# Altium schematic sheet CameraJPEG.SchDoc
size A3; PageSetup: Record=PageOptions|CenterHorizontal=True|CenterVertical=True|PrintScale=0.75|XCorrection=1.00|YCorrection=1.00|PrintKind=1|BorderSize=5000000|LeftOffset=0|BottomOffset=0|Orientation=2|PaperLength=1000|PaperWidth=1000|Scale=100|PaperSource=259|PrintQuality=-3|MediaType=1|DitherType=10|PrintScaleMode=1|PaperKind=A4|PaperIndex=9
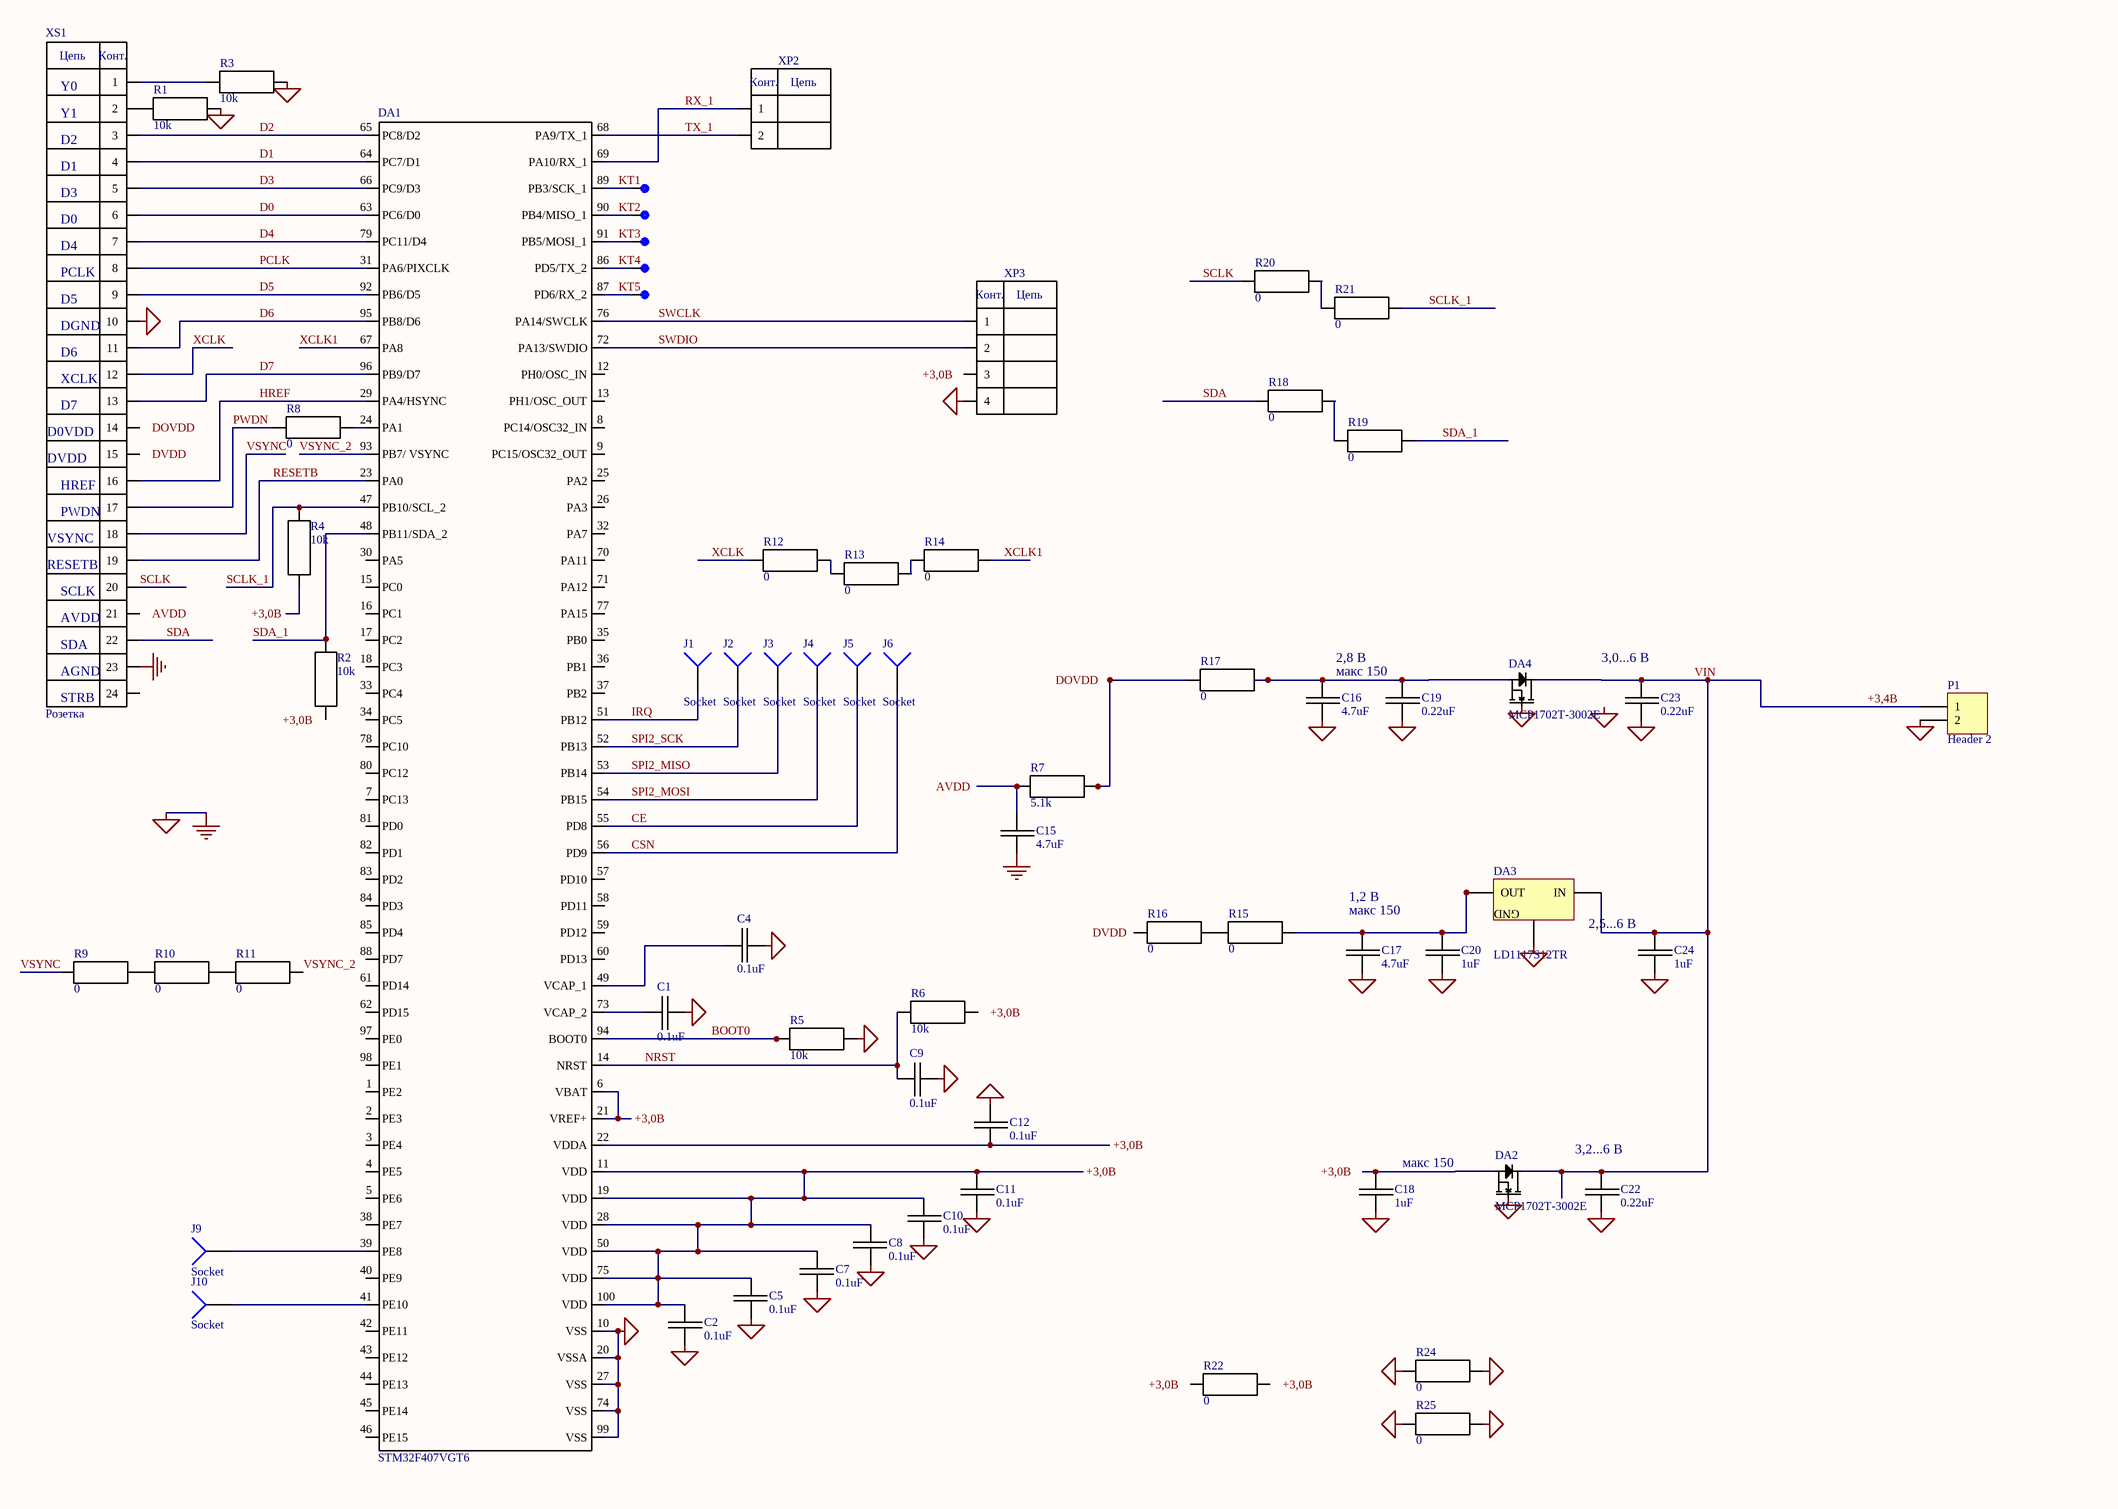
[diagram p0: CameraJPEG.SchDoc]

## Parts
C1  0.1uF  [CAP0805]
C2  0.1uF  [CAP0805]
C4  0.1uF  [CAP0805]
C5  0.1uF  [CAP0805]
C7  0.1uF  [CAP0805]
C8  0.1uF  [CAP0805]
C9  0.1uF  [CAP0805]
C10  0.1uF  [CAP0805]
C11  0.1uF  [CAP0805]
C12  0.1uF  [CAP0805]
C15  4.7uF  [CAP0805]
C16  4.7uF  [CAP0805]
C17  4.7uF  [CAP0805]
C18  1uF  [CAP0805]
C19  0.22uF  [CAP0805]
C20  1uF  [CAP0805]
C22  0.22uF  [CAP0805]
C23  0.22uF  [CAP0805]
C24  1uF  [CAP0805]
DA1  STM32F407VGT6  [STM32F407VGT6]
DA2  MCP1702T-3002E  [SOT23]
DA3  LD1117S12TR  [SOT-223]
DA4  MCP1702T-3002E  [SOT23]
J1  Socket  [PIN1]
J2  Socket  [PIN1]
J3  Socket  [PIN1]
J4  Socket  [PIN1]
J5  Socket  [PIN1]
J6  Socket  [PIN1]
J9  Socket  [PIN1]
J10  Socket  [PIN1]
KT1  *  [PAD]  (value not drawn)
KT2  *  [PAD]  (value not drawn)
KT3  *  [PAD]  (value not drawn)
KT4  *  [PAD]  (value not drawn)
KT5  *  [PAD]  (value not drawn)
P1  Header 2  [HDR1X2]
R1  10k  [RES0603]
R2  10k  [RES0603]
R3  10k  [RES0603]
R4  10k  [RES0603]
R5  10k  [RES0603]
R6  10k  [RES0603]
R7  5.1k  [RES0603]
R8  0  [RES0603]
R9  0  [RES0603]
R10  0  [RES0603]
R11  0  [RES0603]
R12  0  [RES0603]
R13  0  [RES0603]
R14  0  [RES0603]
R15  0  [RES0603]
R16  0  [RES0603]
R17  0  [RES0603]
R18  0  [RES0603]
R19  0  [RES0603]
R20  0  [RES0603]
R21  0  [RES0603]
R22  0  [RES0603]
R24  0  [RES1206]
R25  0  [RES1206]
XP2  Вилка PLS2-2  [PLS2-2]  (value not drawn)
XP3  Вилка PLS2-4  [PLS2-4]  (value not drawn)
XS1  Розетка  [Розетка под FPC_1]

## Ports
+3,0B (out), AVDD (out), DOVDD (out), DVDD (out)

## Nets
GND: C1.2 C2.1 C4.1 C5.2 C7.2 C8.2 C9.2 C10.1 C11.1 C12.2 C15.1 C16.1 C17.1 C18.1 C19.1 C20.1 C22.1 C23.1 C24.1 DA1.10(VSS) DA1.20(VSSA) DA1.27(VSS) DA1.74(VSS) DA1.99(VSS) DA2.1(G) DA3.1(GND) DA4.1(G) P1.2 R1.2 R3.2 R5.2 R24.1 R24.2 R25.1 R25.2 XP3.4 XS1.10 XS1.23
+3,0B: C2.2 C5.1 C7.1 C8.1 C10.2 C11.2 C12.1 C18.2 DA1.6(VBAT) DA1.11(VDD) DA1.19(VDD) DA1.21(VREF+) DA1.22(VDDA) DA1.28(VDD) DA1.50(VDD) DA1.75(VDD) DA1.100(VDD) DA2.2(S) R2.1 R4.1 R6.2 R22.1 R22.2 XP3.3 ; port +3,0B
+3,4B: C22.2 C23.2 C24.2 DA2.3(D) DA3.3(IN) DA4.3(D) P1.1  [also labelled VIN]
AVDD: C15.2 R7.1 XS1.21 ; port AVDD
BOOT0: DA1.94(BOOT0) R5.1
CE: DA1.55(PD8) J5.1
CSN: DA1.56(PD9) J6.1
D0: DA1.63(PC6/D0) XS1.6
D1: DA1.64(PC7/D1) XS1.4
D2: DA1.65(PC8/D2) XS1.3
D3: DA1.66(PC9/D3) XS1.5
D4: DA1.79(PC11/D4) XS1.7
D5: DA1.92(PB6/D5) XS1.9
D6: DA1.95(PB8/D6) XS1.11
D7: DA1.96(PB9/D7) XS1.13
DOVDD: R7.2 R17.1 XS1.14 ; port DOVDD
DVDD: R16.1 XS1.15 ; port DVDD
HREF: DA1.29(PA4/HSYNC) XS1.16
IRQ: DA1.51(PB12) J1.1
KT1: DA1.89(PB3/SCK_1) KT1.1
KT2: DA1.90(PB4/MISO_1) KT2.1
KT3: DA1.91(PB5/MOSI_1) KT3.1
KT4: DA1.86(PD5/TX_2) KT4.1
KT5: DA1.87(PD6/RX_2) KT5.1
NRST: C9.1 DA1.14(NRST) R6.1
PCLK: DA1.31(PA6/PIXCLK) XS1.8
PWDN: R8.1 XS1.17
RESETB: DA1.23(PA0) XS1.19
RX_1: DA1.69(PA10/RX_1) XP2.1
SCLK: R20.1 XS1.20
SCLK_1: DA1.47(PB10/SCL_2) R4.2 R21.2
SDA: R18.1 XS1.22
SDA_1: DA1.48(PB11/SDA_2) R2.2 R19.2
SPI2_MISO: DA1.53(PB14) J3.1
SPI2_MOSI: DA1.54(PB15) J4.1
SPI2_SCK: DA1.52(PB13) J2.1
SWCLK: DA1.76(PA14/SWCLK) XP3.1
SWDIO: DA1.72(PA13/SWDIO) XP3.2
TX_1: DA1.68(PA9/TX_1) XP2.2
VSYNC: R9.1 XS1.18
VSYNC_2: DA1.93(PB7/_VSYNC) R11.2
XCLK: R12.1 XS1.12
XCLK1: DA1.67(PA8) R14.2
NetC1_1: C1.1 DA1.73(VCAP_2)
NetC4_2: C4.2 DA1.49(VCAP_1)
NetC16_2: C16.2 C19.2 DA4.2(S) R17.2
NetC17_2: C17.2 C20.2 DA3.2(OUT) DA3.4 R15.2
NetDA1_24: DA1.24(PA1) R8.2
NetDA1_39: DA1.39(PE8) J9.1
NetDA1_41: DA1.41(PE10) J10.1
NetR1_1: R1.1 XS1.2
NetR3_1: R3.1 XS1.1
NetR9_2: R9.2 R10.1
NetR10_2: R10.2 R11.1
NetR12_2: R12.2 R13.1
NetR13_2: R13.2 R14.1
NetR15_1: R15.1 R16.2
NetR18_2: R18.2 R19.1
NetR20_2: R20.2 R21.1

Not connected (* = marked no-connect by the designer): DA1 1(PE2) 2(PE3) 3(PE4) 4(PE5) 5(PE6) 7(PC13) 8(PC14/OSC32_IN) 9(PC15/OSC32_OUT) 12(PH0/OSC_IN) 13(PH1/OSC_OUT) 15(PC0) 16(PC1) 17(PC2) 18(PC3) 25(PA2) 26(PA3) 30(PA5) 32(PA7) 33(PC4) 34(PC5) 35(PB0) 36(PB1) 37(PB2) 38(PE7) 40(PE9) 42(PE11) 43(PE12) 44(PE13) 45(PE14) 46(PE15) 57(PD10) 58(PD11) 59(PD12) 60(PD13) 61(PD14) 62(PD15) 70(PA11) 71(PA12) 77(PA15) 78(PC10) 80(PC12) 81(PD0) 82(PD1) 83(PD2) 84(PD3) 85(PD4) 88(PD7) 97(PE0) 98(PE1); XS1 24

## Notes on the sheet
- Y0
- (near XS1) D1
- (near XS1) D2
- Y1
- (near XS1) D0
- (near XS1) D3
- (near XS1) D4
- (near XS1) PCLK
- (near XS1) D5
- (near XS1) XCLK
- (near XS1) DGND
- (near XS1) D6
- (near XS1) D0VDD
- (near XS1) D7
- (near XS1) DVDD
- (near XS1) PWDN
- (near XS1) HREF
- (near XS1) RESETB
- (near XS1) VSYNC
- (near XS1) SDA
- (near XS1) AVDD
- (near XS1) SCLK
- (near XS1) STRB
- (near XS1) AGND
- 2,8 B
- макс 150
- (near C23) 3,0...6 B
- (near C17) 1,2 B
- (near C17) макс 150
- 2,5...6 B
- (near C18) макс 150
- (near C22) 3,2...6 B
- Labels drawn without touching a wire or pin: GND
- (in symbol Вилка PLS2-2) Конт.; Цепь
- (in symbol Вилка PLS2-4) Конт.; Цепь
- (in symbol Розетка на плату под шлейф 24_1) Цепь; Конт.

## Library data of the parts
C1 C2 C4 C5 C7-C12 C15-C20 C22-C24 = Capacitor: Voltage: 50V; dielectric: X7R
  C1 C2 C4 C5 C7-C12: Value: 0.1uF
  C15-C17: Value: 4.7uF
  C18 C20 C24: Value: 1uF
  C19 C22 C23: Value: 0.22uF
DA1 = STM32F407VGT6: Manufacturer: STMicroelectronics; Additionally: *; Note: *; PartNumber: STM32F407VGT6; Pattern: *; PowerSupply: *; Tolerance: *; Наименование: *; Value: *
DA2 DA4 = 2N7002: Vds: 60V; Rds: 2-4; Id: 300mA; Vgs: 1...2.5V
DA3 = DA-AMS1117: LDO 3.3V 0.5A; Vin: ...15V; Iout: 0.8A; Vout: 1.2V
KT1-KT5 = KT: Additionally: *; Manufacturer: *; Note: *; PartNumber: *; Pattern: *; PowerSupply: *; Tolerance: *; Наименование: *; Value: *
P1 = Header 2: Header, 2-Pin; LatestRevisionDate: 17-Jul-2002; LatestRevisionNote: Re-released for DXP Platform.; Publisher: Altium Limited
R1-R22 R24 R25 = Resistor: Toleance: 1%
  R1-R6: Value: 10k
  R7: Value: 5.1k
  R8-R22 R24 R25: Value: 0
XP2 = Вилка PLS2-2: Manufacturer: Dragon City; Additionally: *; Note: *; PartNumber: Вилка PLS2-2; Pattern: *; PowerSupply: *; Tolerance: *; Наименование: *; Value: *
XP3 = Вилка PLS2-4: Manufacturer: Dragon City; Additionally: *; Note: *; PartNumber: Вилка PLS2-4; Pattern: *; PowerSupply: *; Tolerance: *; Наименование: *; Value: *
XS1 = Розетка на плату под шлейф 24_1: Additionally: *; Note: *; PartNumber: Розетка; Pattern: *; PowerSupply: *; Tolerance: *; Наименование: *; Value: *
J1-J6 J9 J10 = Socket: LatestRevisionDate: 17-Jul-2002; LatestRevisionNote: Re-released for DXP Platform.; Publisher: Altium Limited